# EAGLE board PoE_mag_main_alt3 (EAGLE 6.4)
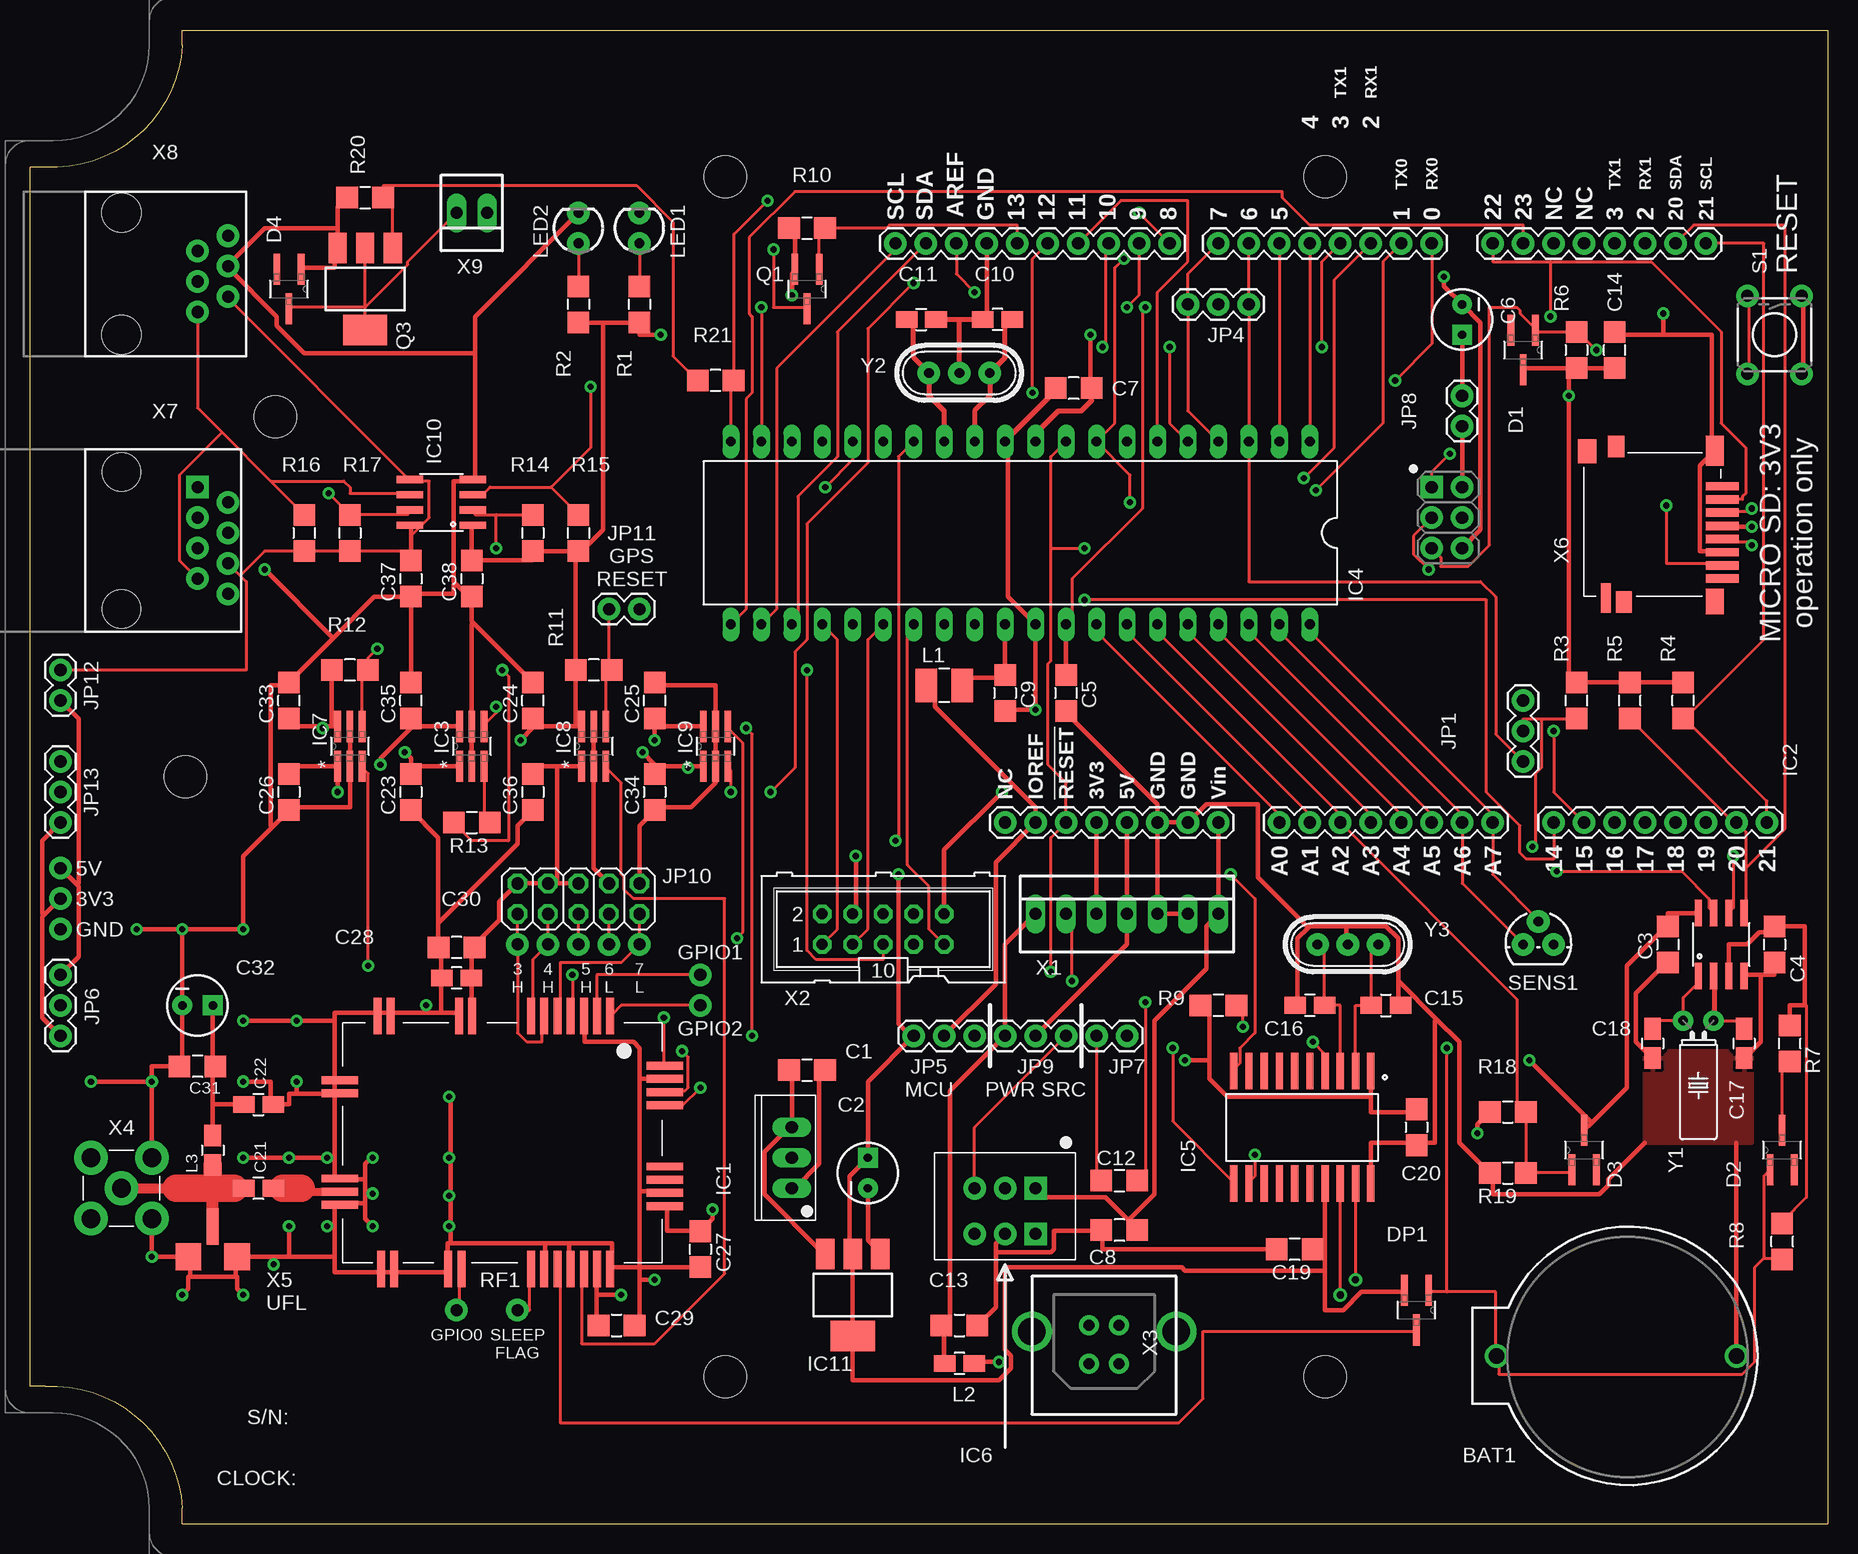
[diagram p4: board, top side]
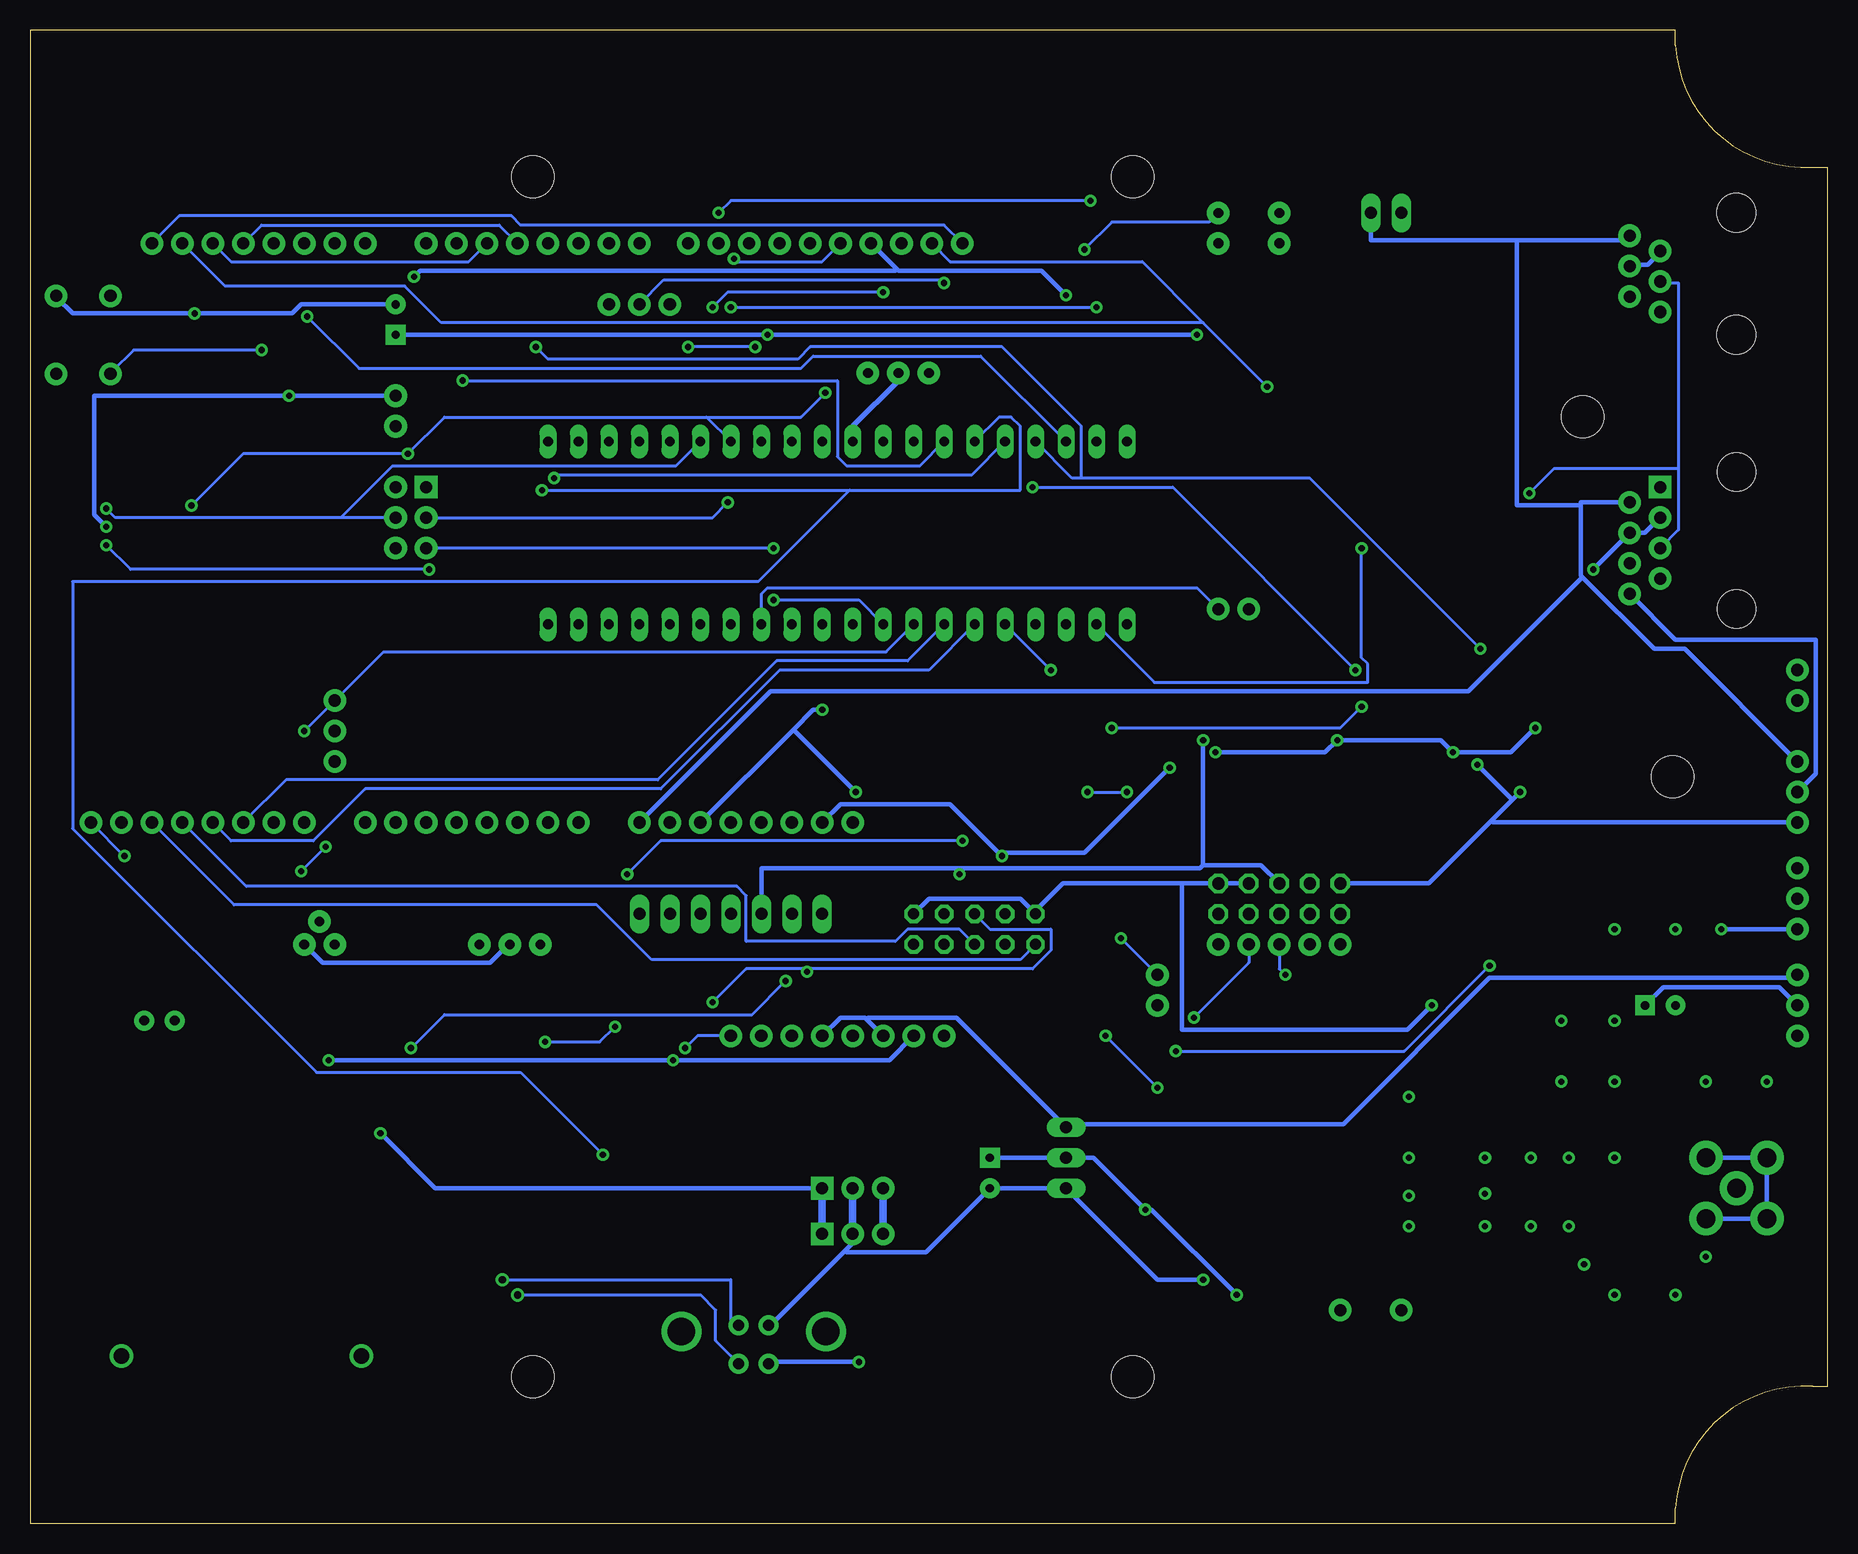
[diagram p5: board, bottom side, seen from below]

Size 149.86 x 124.46 mm. Coordinates in mm from the lower left corner, seen from the top.
Copper layers (1*16): Top 0.035mm / dielectric 1.5mm / Bottom 0.035mm
Design rules "SparkFun_Iteadstudio_10_12mil": minimum track width 10mil, minimum drill 20mil, track to track 12mil, track to pad 12mil, pad to pad 12mil, via to via 12mil, smd to smd 12mil, copper to edge 0.5mm, drill to drill 8mil, minimum pad ring 12mil, minimum via ring 10mil, stop-mask expansion 4mil, vias tented up to drill 25mil, thermal gap 10mil
Net classes: 1 power: width 0.381 mm; 2 antenna: width 0.66 mm

## Footprints (pad centres in the part's own frame; a part is rotated, then mirrored left to right if it is on the bottom)
BATTCOM_20MM_PTH = drill 1.3: 1 20,0; 2 0,0
FIBOX-PC-M-95-G-POE-MAG = hole 3.5: 0,50; 0,-50; -50,-50; -50,50; -95,0; -87.5,30
1206-HAND = smd 1.8 x 1.803: 1 -1.499,0; 2 1.499,0
CPOL-RADIAL-10UF-25V = drill 0.7 pad 1.651 square: 1 1.27,0 | drill 0.7 pad 1.651: 2 -1.27,0
0805-HAND = smd 1.8 x 1.4: 1 -1.225,0; 2 1.225,0
SOT23-3-HAND = smd 2.591 x 0.559: 1 -1.651,1.016; 2 -1.651,-1.016; 3 1.651,0
TO220 = drill 1.016 long: 1 -2.54,0; 2 0,0; 3 2.54,0
SO08 = smd 0.61 x 2.21: 1 -1.905,-2.616; 2 -0.635,-2.616; 3 0.635,-2.616; 4 1.905,-2.616; 5 1.905,2.616; 6 0.635,2.616; 7 -0.635,2.616; 8 -1.905,2.616
SOT23-6-HAND = smd 2.591 x 0.559: 1 -1.651,1.016; 2 -1.651,0; 3 -1.651,-1.016; 4 1.651,-1.016; 5 1.651,0; 6 1.651,1.016
DIL40 = drill 0.813 long: 1 -24.13,-7.62; 2 -21.59,-7.62; 3 -19.05,-7.62; 4 -16.51,-7.62; 5 -13.97,-7.62; 6 -11.43,-7.62; 7 -8.89,-7.62; 8 -6.35,-7.62; 9 -3.81,-7.62; 10 -1.27,-7.62; 11 1.27,-7.62; 12 3.81,-7.62; 13 6.35,-7.62; 14 8.89,-7.62; 15 11.43,-7.62; 16 13.97,-7.62; 17 16.51,-7.62; 18 19.05,-7.62; 19 21.59,-7.62; 20 24.13,-7.62; 21 24.13,7.62; 22 21.59,7.62; 23 19.05,7.62; 24 16.51,7.62; 25 13.97,7.62; 26 11.43,7.62; 27 8.89,7.62; 28 6.35,7.62; 29 3.81,7.62; 30 1.27,7.62; 31 -1.27,7.62; 32 -3.81,7.62; 33 -6.35,7.62; 34 -8.89,7.62; 35 -11.43,7.62; 36 -13.97,7.62; 37 -16.51,7.62; 38 -19.05,7.62; 39 -21.59,7.62; 40 -24.13,7.62
SO20 = smd 0.61 x 3.048: 1 -5.715,-4.699; 2 -4.445,-4.699; 3 -3.175,-4.699; 4 -1.905,-4.699; 5 -0.635,-4.699; 6 0.635,-4.699; 7 1.905,-4.699; 8 3.175,-4.699; 9 4.445,-4.699; 10 5.715,-4.699; 11 5.715,4.699; 12 4.445,4.699; 13 3.175,4.699; 14 1.905,4.699; 15 0.635,4.699; 16 -0.635,4.699; 17 -1.905,4.699; 18 -3.175,4.699; 19 -4.445,4.699; 20 -5.715,4.699
TSR-1-XXXX/POWERPAX-P78XX-10 = drill 1 pad 1.88 square: 1@A -2.54,0; 1@B -2.54,3.81 | drill 1 pad 1.88: 2@A 0,0; 2@B 0,3.81; 3@A 2.54,0; 3@B 2.54,3.81
SOT223-HAND = smd 1.524 x 2.54: 1 -2.3,-3.429; 2 0,-3.429; 3 2.3,-3.429 | smd 3.683 x 2.54: 4 0,3.429
1X03 = drill 1.016 pad 1.88: 1 0,0; 2 2.54,0; 3 5.08,0
1X02 = drill 1.016 pad 1.88: 1 0,0; 2 2.54,0
2X05 = drill 1.016 octagon: 1 -5.08,-1.27; 2 -5.08,1.27; 3 -2.54,-1.27; 4 -2.54,1.27; 5 0,-1.27; 6 0,1.27; 7 2.54,-1.27; 8 2.54,1.27; 9 5.08,-1.27; 10 5.08,1.27
1210-HAND = smd 1.8 x 2.794: 1 -1.499,0; 2 1.499,0
LED3MM = drill 0.813 pad 1.88: A -1.27,0; K 1.27,0
NVC08C-CSM-HAND = smd 0.66 x 3.048: P$1 -9,-10.535; P$2 -7.9,-10.535; P$3 -6.8,-10.535; P$4 -5.7,-10.535; P$5 -4.6,-10.535; P$6 -3.5,-10.535; P$7 -2.4,-10.535; P$8 2.5,-10.535; P$9 3.6,-10.535; P$10 9.3,-10.535; P$11 10.4,-10.535; P$17 10.1,10.535; P$18 9,10.535; P$19 4.5,10.535; P$20 3.4,10.535; P$21 -2.4,10.535; P$22 -3.5,10.535; P$23 -4.6,10.535; P$24 -5.7,10.535; P$25 -6.8,10.535; P$26 -7.9,10.535; P$27 -9,10.535 | smd 3.048 x 0.66: P$12 13.535,-5.2; P$13 13.535,-4.1; P$14 13.535,3; P$15 13.535,4.1; P$16 13.535,5.2; P$28 -13.535,5.3; P$29 -13.535,4.2; P$30 -13.535,3.1; P$31 -13.535,2; P$32 -13.535,-3.1; P$33 -13.535,-4.2; P$34 -13.535,-5.3; P$35 -13.535,-6.4
TACTILE-PTH = drill 1.016 pad 1.88: 1 -3.251,2.261; 2 3.251,2.261; 3 -3.251,-2.261; 4 3.251,-2.261
TO-92 = drill 0.813 pad 1.88: 1 -1.27,0; 2 0,1.905; 3 1.27,0
CALUNIUM-SHIELD-NO-OUTLINE-NO-HOLES-NO-TEXT-V3 = drill 1.016 pad 1.88: 0(RX0) 0,21.59; 1(TX0) -2.54,21.59; 2@0 -5.08,21.59; 2@1 17.78,21.59; 3.3V -27.94,-26.67; 3@0 -7.62,21.59; 3@1 15.24,21.59; 4 -10.16,21.59; 5 -12.7,21.59; 5V -25.4,-26.67; 6 -15.24,21.59; 7 -17.78,21.59; 8 -21.844,21.59; 9 -24.384,21.59; 10 -26.924,21.59; 11@0 -29.464,21.59; 12@0 -32.004,21.59; 13@0 -34.544,21.59; 14 10.16,-26.67; 15 12.7,-26.67; 16 15.24,-26.67; 17 17.78,-26.67; 18 20.32,-26.67; 19 22.86,-26.67; 20@0 25.4,-26.67; 20@1 20.32,21.59; 21@0 27.94,-26.67; 21@1 22.86,21.59; 22 5.08,21.59; 23 7.62,21.59; !ISP_RESET 0,-3.81; !RESET@0 -30.48,-26.67; A0 -12.7,-26.67; A1 -10.16,-26.67; A2 -7.62,-26.67; A3 -5.08,-26.67; A4/SDA -2.54,-26.67; A5/SCL 0,-26.67; A6 2.54,-26.67; A7 5.08,-26.67; AREF -39.624,21.59; GND@0 -22.86,-26.67; GND@1 -20.32,-26.67; GND@2 -37.084,21.59; GND@3 2.54,-3.81; IOREF -33.02,-26.67; ISP_MOSI 2.54,-1.27; ISP_SCK 0,-1.27; ISP_VCC 2.54,1.27; NC -35.56,-26.67; NC@0 12.7,21.59; NC@1 10.16,21.59; SCL -44.704,21.59; SDA -42.164,21.59; VIN -17.78,-26.67 | drill 1.016 pad 1.88 square: ISP_MISO 0,1.27
PAD = drill 1.016 pad 1.88: 1 0,0
22-23-2071 = drill 1 long: 1 -7.62,0; 2 -5.08,0; 3 -2.54,0; 4 0,0; 5 2.54,0; 6 5.08,0; 7 7.62,0
CON-HARTING-ML10 = drill 0.914 octagon: 1 -5.08,-1.27; 2 -5.08,1.27; 3 -2.54,-1.27; 4 -2.54,1.27; 5 0,-1.27; 6 0,1.27; 7 2.54,-1.27; 8 2.54,1.27; 9 5.08,-1.27; 10 5.08,1.27
USB-B-PTH-VERTICAL = drill 0.92 pad 1.676: D+ -1.25,0; D- -1.25,3.2; GND 1.25,0; VBUS 1.25,3.2 | drill 2.3: P$1 -6.02,0.5; P$2 6.02,0.5
SMA-THD = drill 1.549 pad 2.794: GND@0 -2.54,2.54; GND@1 2.54,2.54; GND@2 2.54,-2.54; GND@3 -2.54,-2.54; SIG 0,0
CONN-UFL-HAND-SOLDERING = smd 2.134 x 2.235: GND@0 -2.032,0; GND@1 2.032,0 | smd 1.016 x 3.048: SIGNAL 0,-2.54
MICRO-SD-SOCKET-HIROSE-DM3D = smd 0.7 x 2.75: CD/DAT3 6.6,-1.375; CLK 3.3,-1.375; CMD 5.5,-1.375; DAT0 1.1,-1.375; DAT1 0,-1.375; DAT2 7.7,-1.375; GND 2.2,-1.375; VDD 4.4,-1.375 | smd 1.8 x 1.3: P$11 -1.95,6.85 | smd 2.45 x 0.8: P$12 -1.625,8.35 | smd 1.8 x 1.4: P$13 11,7.5 | smd 2 x 1.55: P$14 10.6,9.925 | smd 2.5 x 1.5: SHIELD@0 10.65,-0.75 | smd 2.1 x 1.5: SHIELD@1 -1.9,-0.75
RJ45-8 = drill 1 pad 1.88 square: 1 -4.445,6.35 | drill 1 pad 1.88: 2 -3.175,8.89; 3 -1.905,6.35; 4 -0.635,8.89; 5 0.635,6.35; 6 1.905,8.89; 7 3.175,6.35; 8 4.445,8.89 | hole 3.2: -5.715,0; 5.715,0
RJ11-6 = drill 1.016 pad 1.88: 1 1.905,8.89; 2 3.175,6.35; 3 4.445,8.89; 4 5.715,6.35; 5 6.985,8.89; 6 8.255,6.35 | hole 3.251: 0,0; 10.16,0
22-23-2021 = drill 1 long: 1 -1.27,0; 2 1.27,0
TC38H = drill 0.813 pad 1.676: 1 -1.27,0; 2 1.27,0
HC49U-V-RESONATOR = drill 0.813 pad 1.88: 1 -2.54,0; 2 2.54,0; GND 0,0

## Placement (x,y rotation side)
BAT1  CR2032  [BATTCOM_20MM_PTH]  142.24,13.97 180 top
BOX1  BOXPOE-MAG-150-150  [FIBOX-PC-M-95-G-POE-MAG]  107.95,62.23 0 top
C1  1u  [1206-HAND]  64.77,37.78 0 top
C2  10u  [CPOL-RADIAL-10UF-25V]  69.85,29.21 90 top
C3  100n  [1206-HAND]  136.53,48.26 270 top
C4  100p  [1206-HAND]  145.41,48.26 270 top
C5  100n  [1206-HAND]  86.36,69.22 270 top
C6  4u7  [CPOL-RADIAL-10UF-25V]  119.38,100.33 270 top
C7  100n  [1206-HAND]  87,94.62 180 top
C8  1u  [1206-HAND]  90.81,24.45 180 top
C9  100n  [1206-HAND]  81.28,69.22 270 top
C10  22p  [0805-HAND]  80.64,100.33 180 top
C11  22p  [0805-HAND]  74.3,100.33 0 top
C12  100n  [1206-HAND]  90.81,28.57 0 top
C13  10n  [1206-HAND]  77.47,16.51 0 top
C14  100n  [1206-HAND]  132.08,97.79 90 top
C15  22p  [0805-HAND]  113.03,43.18 0 top
C16  22p  [0805-HAND]  106.68,43.18 180 top
C17  15p  [0805-HAND]  142.88,40 270 top
C18  15p  [0805-HAND]  135.25,40 270 top
C19  100n  [1206-HAND]  105.41,22.86 180 top
C20  100n  [1206-HAND]  115.57,33.02 270 top
C21  22p  [0805-HAND]  19.05,27.94 180 top
C22  22p  [0805-HAND]  19.05,34.92 0 top
C23  100n  [1206-HAND]  31.75,60.96 270 top
C24  100n  [1206-HAND]  41.91,68.58 90 top
C25  100n  [1206-HAND]  52.07,68.58 90 top
C26  100n  [1206-HAND]  21.59,60.96 270 top
C27  1u  [1206-HAND]  55.88,22.86 270 top
C28  22p  [0805-HAND]  35.56,45.47 180 top
C29  1u  [1206-HAND]  48.9,16.51 0 top
C30  1u  [1206-HAND]  35.56,48.01 180 top
C31  1u  [1206-HAND]  13.97,38.1 180 top
C32  4u7  [CPOL-RADIAL-10UF-25V]  13.97,43.18 0 top
C33  100n  [1206-HAND]  21.59,68.58 90 top
C34  100n  [1206-HAND]  52.07,60.96 270 top
C35  100n  [1206-HAND]  31.75,68.58 90 top
C36  100n  [1206-HAND]  41.91,60.96 270 top
C37  100n  [1206-HAND]  31.75,78.74 270 top
C38  100n  [1206-HAND]  36.83,78.74 270 top
D1  BAS40  [SOT23-3-HAND]  124.46,97.79 270 top
D2  BAS40  [SOT23-3-HAND]  146.05,31.11 90 top
D3  BAS40  [SOT23-3-HAND]  129.54,31.11 90 top
D4  BAS21  [SOT23-3-HAND]  21.59,102.87 270 top
DP1  BAS40-05  [SOT23-3-HAND]  115.57,17.78 270 top
IC1  LD1117V33  [TO220]  63.5,30.48 90 top
IC2  DS1338  [SO08]  140.97,48.26 0 top
IC3  74LVC1T45SOT23-HAND  [SOT23-6-HAND]  36.83,64.77 90 top
IC4  ATMEGA1284  [DIL40]  82.55,82.55 180 top
IC5  MCP2200  [SO20]  106.05,33.02 180 top
IC6  TSR 1-2450  [TSR-1-XXXX/POWERPAX-P78XX-10]  81.28,27.94 180 top
IC7  74LVC1T45SOT23-HAND  [SOT23-6-HAND]  26.67,64.77 90 top
IC8  74LVC1T45SOT23-HAND  [SOT23-6-HAND]  46.99,64.77 90 top
IC9  74LVC1T45SOT23-HAND  [SOT23-6-HAND]  57.15,64.77 90 top
IC10  PCA9517A  [SO08]  34.29,85.09 90 top
IC11  LD1117V33  [SOT223-HAND]  68.58,19.05 180 top
JP1  SQW  [1X03]  124.46,68.58 270 top
JP4  PPS  [1X03]  96.52,101.6 0 top
JP5  3V3/5V  [1X03]  73.66,40.64 0 top
JP6  V ANT  [1X03]  2.54,45.72 270 top
JP7  AUTO RST  [1X02]  91.44,40.64 180 top
JP8  ISP VCC  [1X02]  119.38,91.44 90 top
JP9  USB/VIN  [1X03]  86.36,40.64 180 top
JP10  CONFIG  [2X05]  45.72,52.07 0 top
JP11  GPS !RESET! (A0)  [1X02]  50.8,76.2 180 top
JP12  5V LINK  [1X02]  2.54,68.58 90 top
JP13  MAG VCC  [1X03]  2.54,63.5 270 top
L1  10uH  [1210-HAND]  76.2,69.85 180 top
L2  FERRITE  [0805-HAND]  77.47,13.33 180 top
L3  47n  [0805-HAND]  15.24,31.11 270 top
LED1  D13  [LED3MM]  50.8,107.95 90 top
LED2  PWR  [LED3MM]  45.72,107.95 90 top
Q1  BSS138  [SOT23-3-HAND]  64.77,102.87 270 top
Q3  BUK98150-55A  [SOT223-HAND]  27.94,102.87 180 top
R1  560R  [1206-HAND]  50.8,101.6 270 top
R2  560R  [1206-HAND]  45.72,101.6 270 top
R3  10k  [1206-HAND]  128.91,68.58 90 top
R4  4k7  [1206-HAND]  137.79,68.58 90 top
R5  4k7  [1206-HAND]  133.35,68.58 90 top
R6  10k  [1206-HAND]  128.91,97.79 270 top
R7  1k  [1206-HAND]  146.69,40 90 top
R8  0R  [1206-HAND]  146.05,23.49 90 top
R9  1k  [1206-HAND]  99.06,43.18 180 top
R10  1M  [1206-HAND]  64.77,107.95 0 top
R11  10k  [1206-HAND]  46.99,71.12 180 top
R12  100k  [1206-HAND]  26.67,71.12 180 top
R13  10k  [1206-HAND]  36.83,58.42 0 top
R14  10k  [1206-HAND]  41.91,82.55 270 top
R15  10k  [1206-HAND]  45.72,82.55 270 top
R16  10k  [1206-HAND]  22.86,82.55 270 top
R17  10k  [1206-HAND]  26.67,82.55 270 top
R18  3k 1%  [1206-HAND]  123.19,34.29 0 top
R19  1k 1%  [1206-HAND]  123.19,29.21 0 top
R20  1M  [1206-HAND]  27.94,110.49 0 top
R21  330R  [1206-HAND]  57.15,95.25 180 top
RF1  NV08C-CSM  [NVC08C-CSM-HAND]  39.37,31.75 180 top
S1  RESET  [TACTILE-PTH]  145.41,99.06 270 top
SENS1  LM61  [TO-92]  125.73,48.26 0 top
U$1  CALUNIUM-SHIELD-V3V3-NO-HOLES-NO-TEXT  [CALUNIUM-SHIELD-NO-OUTLINE-NO-HOLES-NO-TEXT-V3]  116.84,85.09 0 top
U$2  PAD  [PAD]  40.64,17.78 270 top
U$3  PAD  [PAD]  35.56,17.78 270 top
U$4  PAD  [PAD]  55.88,45.72 270 top
U$5  ?  [PAD]  55.88,43.18 270 top
U$6  PAD  [PAD]  40.64,48.26 270 top
U$7  PAD  [PAD]  43.18,48.26 270 top
U$8  PAD  [PAD]  45.72,48.26 270 top
U$9  PAD  [PAD]  48.26,48.26 270 top
U$10  PAD  [PAD]  50.8,48.26 270 top
U$11  PAD  [PAD]  2.54,52.07 0 top
U$12  PAD  [PAD]  2.54,54.61 0 top
U$13  PAD  [PAD]  2.54,49.53 0 top
X1  PWR  [22-23-2071]  91.44,50.8 0 top
X2  JTAG  [CON-HARTING-ML10]  71.12,49.53 0 top
X3  USB  [USB-B-PTH-VERTICAL]  89.53,16.51 180 top
X4  CONN-SMATHD  [SMA-THD]  7.62,27.94 270 top
X5  UFL  [CONN-UFL-HAND-SOLDERING]  15.24,22.22 180 top
X6  MICRO-SD-SOCKETHIROSE-DM3D  [MICRO-SD-SOCKET-HIROSE-DM3D]  139.7,78.74 90 top
X7  RJ45  [RJ45-8]  7.62,81.91 270 top
X8  RJ11  [RJ11-6]  7.62,109.22 270 top
X9  22-23-2021  [22-23-2021]  36.83,109.22 180 top
Y1  32k768  [TC38H]  139.06,41.91 180 top
Y2  16MHz  [HC49U-V-RESONATOR]  77.47,95.88 180 top
Y3  12MHz  [HC49U-V-RESONATOR]  109.86,48.26 180 top

## Tracks (layer width: path | path; a pad name or v marks a point on that pad's centre or on a via)
0(RX0)  (via drill 0.51)
  Top 0.254: v113.79,95.25 116.84,98.3 U$1.0(RX0) | v100.08,54.1 102.11,52.07 102.11,40.89 100.84,39.62 100.84,38.35 100.33,37.85 IC5.10 | v72.14,56.9 72.39,57.15 72.39,88.9 IC4.14
  Bottom 0.254: IC4.14 75.69,88.14 81.79,88.14 82.55,88.9 82.55,95.25 v113.79,95.25 | v100.08,54.1 97.28,56.9 v72.14,56.9
1(TX0)  (via drill 0.51)
  Top 0.254: v107.19,86.11 112.78,91.69 112.78,105.16 U$1.1(TX0) | v102.11,30.73 102.11,28.96 101.6,28.45 IC5.12
  Bottom 0.254: IC4.15 69.09,92.2 68.07,92.2 67.31,91.44 67.31,86.11 81.53,86.11 | v107.19,86.11 81.53,86.11 | v102.11,30.73 108.97,37.59 125.98,37.59 146.3,57.91 146.3,78.49 89.15,78.49 81.53,86.11
2(RX1)  (via drill 0.51)
  Top 0.254: v39.37,71.12 39.88,70.61 39.88,56.9 36.83,56.9 36.07,57.66 36.07,57.91 35.56,58.42 R13.1 | v66.29,86.36 68.58,88.65 IC4.16 | U$1.2@0 108.71,103.63 108.71,89.66 v106.17,87.12
  Bottom 0.254: U$1.2@0 113.28,105.16 133.1,105.16 U$1.2@1 | v39.37,71.12 54.61,86.36 v66.29,86.36 | v106.17,87.12 105.92,87.38 71.37,87.38 IC4.16
3(TX1)  (via drill 0.51)
  Top 0.254: IC7.4 27.69,70.87 27.94,71.12 R12.1 28.19,71.12 28.19,72.14 v28.96,72.9 | U$1.3@0 107.7,105.16 v107.7,98.04
  Bottom 0.254: U$1.3@0 110.74,108.2 130.56,108.2 U$1.3@1 | IC4.17 62.99,87.12 62.23,87.12 | 62.23,87.12 43.18,87.12 v28.96,72.9 | v107.7,98.04 106.68,97.03 85.85,97.03 84.84,98.04 68.83,98.04 62.23,91.44 62.23,87.12
4
  Top 0.254: U$1.4 IC4.1
5
  Top 0.254: U$1.5 IC4.2
6
  Top 0.254: U$1.6 JP4.3 IC4.3 101.6,78.49 120.9,78.49 122.17,77.22 122.17,65.79 JP1.3
7
  Top 0.254: IC4.4 96.52,92.71 JP4.1 96.52,104.14 U$1.7
8  (via drill 0.51)
  Top 0.254: IC4.20 58.42,95.25 R21.1 58.67,95.25 58.67,107.44 v61.47,110.24 | v92.46,109.22 U$1.8
  Bottom 0.254: v92.46,109.22 91.44,110.24 v61.47,110.24
9  (via drill 0.51)
  Top 0.254: v60.96,101.35 IC4.19 | v91.44,101.35 92.46,102.36 U$1.9
  Bottom 0.254: v91.44,101.35 v60.96,101.35
10  (via drill 0.51)
  Top 0.254: IC4.5 95,91.69 v95,98.04 | v89.41,98.04 89.66,98.3 89.66,106.43 U$1.10
  Bottom 0.254: v89.41,98.04 v95,98.04
11(MOSI)  (via drill 0.51)
  Top 0.254: v143.51,84.58 143.51,84.33 141.22,84.33 X6.CMD | U$1.11@0 90.93,110.24 96.52,110.24 96.52,105.16 93.98,102.62 IC4.6
  Bottom 0.254: v143.51,84.58 142.75,83.82 123.95,83.82 | U$1.ISP_MOSI 123.95,83.82 | IC4.6 96.01,88.14 119.63,88.14 123.95,83.82
12(MISO)  (via drill 0.51)
  Top 0.254: v136.4,84.84 136.4,80.01 140.97,80.01 X6.DAT0 | v118.36,89.15 116.84,87.63 U$1.ISP_MISO | U$1.12@0 83.57,105.41 v83.57,94.23
  Bottom 0.254: v136.4,84.84 132.08,89.15 v118.36,89.15 115.32,92.2 93.47,92.2 | 93.47,92.2 IC4.7 | v83.57,94.23 85.6,92.2 93.47,92.2
13(SCK)  (via drill 0.51)
  Top 0.254: Q1.1 65.79,107.7 66.04,107.95 R10.2 71.37,107.95 71.63,108.2 82.3,108.2 U$1.13@0 | v143.51,81.53 143.51,81.79 141.22,81.79 X6.CLK | v116.59,79.5 115.32,80.77 115.32,82.3 U$1.ISP_SCK | v91.69,85.09 91.69,87.38 IC4.8 90.42,91.69 90.42,104.65 v91.19,105.41
  Bottom 0.254: v143.51,81.53 141.48,79.5 v116.59,79.5 | v91.69,85.09 92.96,83.82 U$1.ISP_SCK | U$1.13@0 83.82,105.16 90.93,105.16 v91.19,105.41
14  (via drill 0.51)
  Top 0.254: v87.88,76.96 121.41,76.96 121.41,60.96 124.21,58.17 124.21,55.88 124.71,55.37 127,55.37 U$1.14
  Bottom 0.254: IC4.29 80.77,76.96 v87.88,76.96
15  (via drill 0.51)
  Top 0.254: U$1.15 127,60.96 v127,66.04
  Bottom 0.254: IC4.28 78.49,72.64 120.4,72.64 JP1.1 v127,66.04
16(TDI)
  Top 0.254: IC4.27 73.15,74.42 73.15,54.86 74.93,53.09 74.93,49.53 X2.9
  Bottom 0.254: U$1.16 128.52,61.98 97.54,61.98 87.63,71.88 76.71,71.88 IC4.27
17(TDO)
  Top 0.254: IC4.26 69.85,73.66 69.85,49.53 X2.3
  Bottom 0.254: U$1.17 133.1,56.9 126.24,56.9 121.92,61.21 97.28,61.21 87.38,71.12 74.93,71.12 IC4.26
18(TMS)  (via drill 0.51)
  Top 0.254: v64.77,71.12 64.77,47.75 65.53,46.99 71.12,46.99 X2.5
  Bottom 0.254: v64.77,71.12 IC4.25 | U$1.18 131.83,53.09 90.93,53.09 90.17,52.32 90.17,48.51 77.72,48.51 76.71,49.53 72.39,49.53 X2.5
19(TCK)
  Top 0.254: IC4.24 67.31,73.66 67.31,49.53 X2.1
  Bottom 0.254: U$1.19 132.84,51.56 102.62,51.56 98.04,46.99 67.31,46.99 X2.1
20(SDA)  (via drill 0.51)
  Top 0.254: R5.1 133.35,67.06 141.99,58.42 U$1.20@0 143,57.66 143,54.61 | 143,54.61 143,51.05 IC2.5 | U$1.20@1 138.68,108.2 146.3,108.2 146.3,57.91 143,54.61 | 43.43,86.36 45.72,84.07 R15.1 | 43.43,86.36 38.35,86.36 37.85,85.85 37.08,85.85 IC10.3 | IC4.23 64.01,75.44 64.01,85.6 67.31,88.9 67.31,99.31 U$1.SDA | 43.43,86.36 46.74,89.66 v46.74,94.74
  Bottom 0.254: 52.07,100.08 57.15,105.16 73.15,105.16 U$1.SDA | 52.07,100.08 v46.74,94.74 | U$1.20@1 133.6,103.12 118.62,103.12 115.57,100.08 52.07,100.08
21(SCL)  (via drill 0.51)
  Top 0.254: 137.92,67.06 144.78,60.2 U$1.21@0 | v141.99,55.63 141.99,51.31 141.73,51.05 IC2.6 | U$1.21@1 144.53,106.68 144.53,73.66 137.92,67.06 | 137.92,67.06 R4.1 | 38.86,84.07 37.08,84.07 37.08,84.33 IC10.2 | 38.86,84.07 41.91,84.07 R14.1 | IC4.22 62.23,76.2 62.23,96.27 72.14,106.17 U$1.SCL | v38.86,81.28 38.86,84.07
  Bottom 0.254: U$1.21@0 v141.99,55.63 | v38.86,81.28 38.86,72.14 38.35,71.63 38.35,70.1 56.13,70.1 IC4.22 | U$1.21@1 137.41,108.97 109.73,108.97 108.97,108.2 73.66,108.2 U$1.SCL
22  (via drill 0.51)
  Top 0.254: 126.75,105.16 121.92,105.16 U$1.22 | 126.75,105.16 135.13,105.16 140.97,99.31 140.97,91.69 143,89.66 143,85.85 142.75,85.6 142.75,85.34 141.22,85.34 X6.CD/DAT3 | 126.75,105.16 v126.75,100.58
  Bottom 0.254: IC4.18 70.61,97.28 84.58,97.28 85.6,96.27 122.43,96.27 v126.75,100.58
23
  Top 0.254: IC4.21 59.69,76.2 59.69,93.73 60.2,94.23 60.2,100.58 59.94,100.84 59.94,107.19 63.75,111 104.39,111 104.39,110.49 106.68,108.2 124.46,108.2 U$1.23
!GPS_RESET
  Top 0.254: IC8.3 48.01,62.99 49.28,61.72 49.28,54.1 49.53,53.85 49.53,52.83 50.29,52.07 57.91,52.07 57.91,20.83 52.07,14.99 45.97,14.99 45.97,21.08 RF1.P$25
!MCP2200_RESET  (via drill 0.51)
  Top 0.254: v101.09,41.4 101.09,42.67 100.58,43.18 R9.1 | v106.93,40.13 107.95,39.12 IC5.4
  Bottom 0.254: v101.09,41.4 102.36,40.13 v106.93,40.13
!RESET  (via drill 0.51)
  Top 0.254: S1.4 143.26,96.01 143.26,102.11 S1.3 | U$1.!ISP_RESET 117.6,80.52 117.6,79.76 119.89,79.76 121.67,81.53 121.67,101.35 123.95,101.35 124.21,101.09 124.21,100.84 125.48,99.57 D1.1 125.48,99.31 128.78,99.31 R6.1 129.03,99.31 v130.56,97.79 | IC4.9 85.09,88.9 85.09,81.28 | 85.09,81.28 85.09,71.88 84.84,71.63 84.84,63.25 86.36,61.72 U$1.!RESET@0 85.09,57.15 v85.09,45.97 | v92.96,43.43 92.96,29.21 92.46,28.7 C12.2 | 85.09,81.28 v87.88,81.28
  Bottom 0.254: v130.56,97.79 141.22,97.79 143,96.01 S1.4 | v92.96,43.43 90.17,46.23 85.09,46.23 | 85.09,46.23 66.29,46.23 64.77,47.75 64.77,49.53 69.85,49.53 X2.6 | 85.09,46.23 v85.09,45.97 | v87.88,81.28 U$1.!ISP_RESET
+3V3  (via drill 0.51)
  Top 0.381: 36.83,45.72 36.83,48.26 C30.1 | 37.34,48.51 37.08,48.26 C30.1 | 37.47,48.26 37.34,48.51 | 36.83,45.72 36.83,42.42 RF1.P$8 | 36.83,45.72 C28.1 | RF1.P$26 47.24,21.21 47.24,19.05 | 47.24,19.05 47.24,16.51 C29.1 | IC5.17 107.95,22.86 | 107.95,22.86 C19.1 | C26.1 21.59,63.12 IC7.1 v25.65,60.96 | IC3.6 31.75,66.42 C35.1 31.75,66.29 29.21,63.75 v29.21,63.25 | IC8.1 43.94,63.12 | 43.94,63.12 41.91,63.12 C36.1 | IC9.6 52.07,66.42 C25.1 v52.07,65.28 | 55.88,24.38 53.09,24.38 53.09,26.42 RF1.P$28 | 55.88,24.38 56.9,25.4 v56.9,26.16 | 55.88,24.38 C27.1 | v49.28,19.05 47.24,19.05 | 107.95,22.86 107.95,21.08 | 107.95,21.08 107.95,17.78 109.47,17.78 111,19.3 114.55,19.3 DP1.2 | 107.95,21.08 96.27,21.08 96.01,21.34 81.28,21.34 81.28,14.48 81.79,13.97 81.79,12.95 80.77,11.94 68.58,11.94 IC11.4 IC11.2 68.58,22.61 68.33,22.86 68.33,28.96 C2.1 69.85,36.83 JP5.1 73.41,40.64 72.39,41.66 v72.39,54.1 | JP6.3 1.02,42.16 1.02,50.55 1.14,50.67 | U$11.1 1.14,50.67 | JP13.3 1.02,56.9 1.02,50.8 1.14,50.67 | U$1.3.3V X1.3 | 43.94,53.34 JP10.6 | 43.94,53.34 43.94,63.12 | 43.94,53.34 JP10.4 JP10.2 39.12,51.82 39.12,50.29 37.34,48.51 | 37.34,48.51 C30.1
  Bottom 0.381: C2.1 IC1.2 61.21,30.48 v56.9,26.16 56.39,26.16 v49.28,19.05 | 28.07,58.55 33.27,53.34 JP10.2 | 28.07,58.55 26.29,60.32 | 26.29,60.32 v25.65,60.96 | 26.29,60.32 v29.21,63.25 | 52.07,54.86 v52.07,65.28 | 52.07,54.86 47.24,54.86 JP10.6 | X1.3 88.9,54.61 72.39,54.61 | 72.39,54.61 52.32,54.61 52.07,54.86 | JP13.3 27.94,58.42 28.07,58.55 | 72.39,54.61 v72.39,54.1
+5V
  Top 0.381: JP6.1 4.06,47.24 4.06,53.09 3.94,53.21 | U$12.1 3.94,53.21 | JP12.1 4.06,67.06 4.06,53.34 3.94,53.21 | 63.5,33.27 63.5,37.59 C1.1 | 63.5,33.27 61.21,30.99 61.21,27.43 66.04,22.61 IC11.3 | 63.5,33.27 IC1.3 | U$1.5V X1.4 91.44,48.26 JP9.2
  Bottom 0.381: 80.14,42.04 80.26,42.16 82.3,42.16 JP9.2 | 80.14,42.04 JP5.3 | 80.14,42.04 80.01,42.16 72.64,42.16 IC1.3 63.5,33.27 40.39,33.27 28.19,45.47 2.79,45.47 JP6.1
+5V_USB
  Top 0.381: 76.2,16.51 76.2,13.46 L2.2 | 76.2,16.51 76.71,17.02 76.71,36.07 JP9.3 81.28,48.26 X1.1 | 76.2,16.51 C13.1
A0
  Top 0.254: U$1.A0 104.14,59.05 88.9,74.29 IC4.33
  Bottom 0.254: JP11.1 52.58,77.98 88.39,77.98 88.9,77.47 IC4.33
A1
  Top 0.254: U$1.A1 106.68,59.05 91.44,74.29 IC4.34
A2
  Top 0.254: IC4.35 93.98,74.29 109.22,59.05 U$1.A2 123.95,43.69 123.95,34.8 124.46,34.29 R18.2 124.71,34.29 124.71,29.21 | 124.71,29.21 128.52,29.21 D3.1 | 124.71,29.21 R19.2
A3
  Top 0.254: U$1.A3 111.76,59.05 96.52,74.29 IC4.36
A4
  Top 0.254: U$1.A4/SDA 114.3,59.05 99.06,74.29 IC4.37
A5
  Top 0.254: U$1.A5/SCL 116.84,59.05 101.6,74.29 IC4.38
A6
  Top 0.254: IC4.39 104.14,74.29 119.38,59.05 U$1.A6 119.38,53.34 SENS1.1
A7
  Top 0.254: IC4.40 106.68,74.29 121.92,59.05 U$1.A7 121.92,54.1 125.73,50.29 SENS1.2
AREF  (via drill 0.51)
  Top 0.254: IC4.32 86.87,75.44 86.87,78.74 92.71,84.58 92.71,101.09 v92.96,101.35 | v78.74,102.62 77.22,104.14 U$1.AREF
  Top 0.381: IC4.32 86.36,70.87 C5.1 86.36,70.48
  Bottom 0.254: v92.96,101.35 91.69,102.62 v78.74,102.62
AUTO_RESET  (via drill 0.51)
  Top 0.254: v95.25,39.62 95.25,33.53 100.33,28.45 IC5.11
  Bottom 0.254: v95.25,39.62 94.23,40.64 JP7.1
AVCC
  Top 0.381: IC4.30 81.28,70.87 C9.1 81.28,70.48 77.47,70.48 77.47,69.85 L1.1 77.72,69.85 78.11,69.85
FAN_CTRL
  Top 0.254: Q3.4 27.94,101.35 | 27.94,101.35 Q3.2 | 27.94,101.35 21.59,101.35 D4.3 | X9.2 31.5,105.16 31.5,104.9 27.94,101.35
GND  (via drill 0.51)
  Top 0.381: X4.GND@1 v10.16,22.22 X5.GND@1 13.34,22.22 13.34,20.57 | 30.48,20.95 29.21,20.95 | 29.21,20.95 25.4,20.95 25.4,22.22 | 29.21,20.95 RF1.P$17 | 30.48,20.95 34.92,20.95 RF1.P$19 34.8,21.34 34.8,23.37 35.05,23.37 | 30.48,20.95 RF1.P$18 | 25.4,26.67 25.91,26.42 RF1.P$16 25.4,26.67 | 22.23,35.81 25.65,35.81 RF1.P$13 | 25.4,30.48 25.4,35.85 RF1.P$13 | 25.4,30.48 25.4,28.75 RF1.P$14 25.91,28.7 27.94,28.7 | 25.4,36.83 25.4,36.07 RF1.P$13 | 30.1,42.54 29.21,42.54 | 29.21,42.54 RF1.P$11 28.96,42.54 | RF1.P$9 35.56,42.54 34.29,42.54 | 34.29,42.54 33.02,42.54 | 33.02,42.54 30.1,42.54 | 30.1,42.54 RF1.P$10 | 28.96,42.54 29.21,42.54 | 25.4,41.91 25.4,42.54 28.96,42.54 | 25.4,41.91 25.4,36.83 | 25.4,36.83 RF1.P$12 | 27.94,26.67 25.4,26.67 | 27.94,28.7 27.94,27.69 | 27.94,27.69 27.94,26.67 | 25.4,22.22 21.59,22.22 | 21.59,22.22 20.32,22.22 | 20.32,22.22 X5.GND@0 17.14,22.22 17.14,20.57 | 25.4,26.67 25.4,24.89 | 25.4,24.89 25.4,22.22 | 50.8,37.08 52.83,37.08 RF1.P$34 | 50.8,27.69 50.8,37.08 | 50.8,27.69 52.83,27.69 RF1.P$29 | 50.8,37.08 50.8,39.62 50.29,40.13 46.23,40.13 46.23,42.16 RF1.P$3 | 51.05,16.51 50.8,16.51 | 50.8,16.51 C29.2 | IC8.5 IC8.2 46.99,54.61 JP10.8 | 42.93,23.37 42.93,21.34 RF1.P$22 | 44.96,23.37 42.93,23.37 | 44.96,23.37 44.96,21.34 RF1.P$24 | 48.51,21.34 50.8,21.34 | 50.8,21.34 55.88,21.34 C27.2 | 48.51,21.34 RF1.P$27 | 44.96,23.37 48.51,23.37 48.51,21.34 | 50.8,21.34 50.8,27.69 | 42.93,23.37 35.05,23.37 | 34.29,45.72 34.29,48.26 C30.2 34.04,48.26 34.04,50.04 | 34.29,42.54 34.29,45.72 | 34.29,45.72 C28.2 | 17.14,20.57 13.34,20.57 | IC5.20 111.76,31.75 115.57,31.75 | 50.8,21.34 50.8,20.32 | 50.8,20.32 50.8,16.51 | v52.07,20.32 50.8,20.32
  Top 0.381: 142.88,45.49 IC2.4 142.88,45.72 144.27,45.72 | 144.27,45.72 145.41,45.72 C4.2 | 22.23,35.81 21.59,35.81 21.59,34.92 C22.2 20.07,35.05 20.07,36.83 v17.78,36.83 | 22.23,35.81 v22.23,36.83 | C3.2 136.4,46.74 133.86,44.2 133.86,40.13 135.13,38.86 C18.2 | 144.27,45.72 144.27,40.13 143,38.86 C17.2 | 142.24,31.75 BAT1.2 | X1.6 X1.5 U$1.GND@0 | U$1.GND@0 93.98,59.94 86.36,67.56 C5.2 | U$1.GND@0 U$1.GND@1 98.04,59.94 102.36,59.94 102.36,53.85 106.55,49.66 | 106.55,49.66 106.68,49.78 109.73,49.78 | 106.55,49.66 105.66,48.77 105.66,43.18 C16.2 | 109.73,49.78 109.73,48.26 Y3.GND | 114.05,45.21 114.05,48.77 113.03,49.78 109.73,49.78 | 114.05,45.21 114.05,43.18 C15.2 | 114.05,45.21 117.22,42.04 | 117.22,42.04 119.13,40.13 119.13,31.75 121.67,29.21 R19.1 121.92,29.21 121.92,27.43 130.81,27.43 131.57,28.19 131.57,28.7 134.62,31.75 | 115.57,31.75 117.09,31.75 117.09,41.91 117.22,42.04 | 115.57,31.75 C20.2 | 136.14,99.06 140.21,99.06 140.21,89.41 X6.SHIELD@0 140.21,89.15 139.19,88.14 139.19,81.03 140.97,81.03 X6.GND | 136.14,99.06 132.08,99.06 C14.2 | S1.2 147.83,96.01 147.83,102.11 S1.1 | U$1.GND@3 120.9,82.8 120.9,100.08 C6.2 117.86,103.12 v117.86,103.89 | v136.14,100.84 136.14,99.06 | R10.1 63.5,107.95 63.75,107.7 Q1.2 63.75,104.39 63.5,104.14 v63.5,102.36 | C9.2 81.28,67.82 v83.82,67.82 IC4.31 81.53,77.22 81.53,90.17 IC4.11 | U$1.GND@2 79.76,100.58 79.5,100.33 C10.2 | 25.27,73.79 28.7,77.22 31.75,77.22 | 25.27,73.79 21.59,70.1 C33.2 21.59,69.85 20.07,69.85 20.07,58.17 20.19,58.04 | 31.75,77.22 C35.2 | 31.75,77.22 C37.2 31.75,77.47 35.31,77.47 35.31,78.23 35.43,78.36 | 25.27,73.79 v19.56,79.5
  Top 0.381: 25.65,107.95 25.65,106.43 Q3.3 25.4,106.17 25.4,104.65 22.61,104.65 D4.1 | 25.65,107.95 25.65,109.73 26.42,110.49 R20.1 | 25.65,107.95 19.56,107.95 16.51,104.9 X8.3 16.51,104.65 20.57,100.58 20.57,99.82 22.86,97.54 37.08,97.54 | IC3.2 IC3.5 36.83,74.93 36.96,75.06 | 36.83,87.12 IC10.4 | 36.96,75.06 36.83,75.18 36.83,76.96 | 36.96,75.06 41.91,70.1 C24.2 | 36.83,76.96 C38.2 36.83,77.22 | 36.83,76.96 35.43,78.36 | 35.43,78.36 35.31,78.49 35.31,86.87 36.83,86.87 IC10.4 | LED2.K 37.08,100.58 37.08,97.54 | 37.08,97.54 37.08,87.12 IC10.4 | 71.12,22.61 IC11.1 70.87,22.61 69.85,23.62 C2.2 | IC1.1 63.75,27.94 65.79,29.97 65.79,37.34 66.04,37.59 C1.2 | 80.52,22.61 80.52,23.37 IC6.2@B | 80.52,22.61 80.52,18.03 78.99,16.51 C13.2 | 80.52,22.61 85.09,22.61 85.34,22.86 85.34,24.38 89.15,24.38 C8.2 89.41,24.38 89.41,22.86 C19.2 | IC7.5 IC7.2 26.67,59.69 21.59,59.69 C26.2 21.59,59.44 20.19,58.04 | v12.7,49.53 v8.89,49.53 | v12.7,49.53 v17.78,49.53 17.78,55.63 20.19,58.04 | v10.16,36.83 v5.08,36.83 | v10.16,36.83 10.16,38.1 C31.2 12.7,38.1 C32.2 v12.7,49.53 | C25.2 52.07,69.85 57.15,69.85 IC9.5 57.15,63.25 IC9.2 57.15,61.72 55.12,59.69 52.07,59.69 C34.2 52.07,59.44 50.8,58.17 JP10.10 | v17.78,41.91 v22.23,41.91 25.4,41.91 | v17.78,30.48 v21.59,30.48 v24.77,30.48 25.4,30.48 | v12.7,19.05 13.21,19.56 13.21,20.57 13.34,20.57 | v17.78,19.05 17.27,19.56 17.27,20.57 17.14,20.57 | 20.32,22.22 v20.32,21.59 | 21.59,22.22 v21.59,24.76 | 25.4,24.89 24.89,24.89 v24.77,24.76 | v28.57,24.76 27.94,25.4 27.94,26.67 | 35.05,23.37 35.05,24.64 v34.92,24.76 35.05,24.89 35.05,27.18 v34.92,27.3 35.05,27.43 35.05,30.48
  Top 0.381: 27.94,27.69 28.45,27.69 v28.57,27.5 | 27.94,28.7 27.94,29.97 28.45,30.48 v28.57,30.48 | 35.05,30.48 35.05,35.56 v34.92,35.56 | 35.05,30.48 v34.92,30.48 | 33.02,42.54 v33.02,43.18 | 34.04,50.04 34.04,57.15 31.75,59.44 C23.2 | 34.04,50.04 40.64,56.64 40.64,58.17 41.91,59.44 C36.2 | X4.GND@0 v10.16,36.83 | v81.03,60.96 76.2,56.13 X2.10
  Top 0.406: IC4.11 85.5,94.39 C7.2 | Y2.GND 77.47,100.33 | 77.47,100.33 C11.2 | C10.2 77.47,100.33
  Bottom 0.381: X4.GND@0 X4.GND@3 X4.GND@2 X4.GND@1 | SENS1.3 125.48,46.74 111.51,46.74 109.98,48.26 Y3.GND | C6.2 127.25,101.6 128.02,100.84 v136.14,100.84 146.3,100.84 147.57,102.11 S1.1 | v63.5,102.36 65.53,104.39 77.47,104.39 77.6,104.52 | U$1.GND@2 77.6,104.52 | v117.86,103.89 117.35,104.39 77.72,104.39 77.6,104.52 | 86.23,66.17 84.58,67.82 v83.82,67.82 | 86.23,66.17 U$1.GND@0 | X7.3 15.24,82.55 X7.4 v19.56,79.5 | X8.2 13.97,105.92 14.99,104.9 16.51,104.9 X8.3 | 81.92,22.73 81.28,23.37 IC6.2@B | 81.92,22.73 88.14,16.51 X3.GND | 81.92,22.73 81.79,22.61 75.18,22.61 C2.2 IC1.1 55.88,20.32 v52.07,20.32 | v8.89,49.53 U$13.1 | X2.10 74.93,52.07 67.31,52.07 X2.2 66.04,51.05 63.75,53.34 53.85,53.34 | JP10.8 JP10.10 53.85,53.34 | 53.85,53.34 53.85,41.15 35.05,41.15 v33.02,43.18 | v81.03,60.96 86.23,66.17
  Bottom 0.406: Y2.GND 77.47,95.25 81.28,91.44 IC4.11
  pour Top (isolate 0.61): 134.62,39.37 143.51,39.37 143.51,31.75 134.62,31.75
GPIO0
  Top 0.254: U$3.1 35.81,17.78 35.81,21.08 RF1.P$20
GPIO1  (via drill 0.51)
  Top 0.254: U$4.1 47.24,45.72 47.24,42.42 RF1.P$2 | v58.93,48.77 59.44,49.28 59.44,65.02 58.17,66.29 IC9.4
  Bottom 0.254: U$4.1 v58.93,48.77
GPIO2
  Top 0.254: U$5.1 49.28,43.18 48.51,42.42 RF1.P$1
GPIO3
  Top 0.254: RF1.P$6 42.67,42.16 42.67,40.13 41.4,40.13 40.64,40.89 U$6.1 JP10.1
GPIO4
  Top 0.254: RF1.P$7 41.91,42.42 41.91,46.99 U$7.1 JP10.3
GPIO5  (via drill 0.51)
  Top 0.254: v45.21,45.72 45.21,42.42 RF1.P$4 | U$8.1 JP10.5
  Bottom 0.254: v45.21,45.72 45.72,46.23 U$8.1
GPIO6  (via drill 0.51)
  Top 0.254: U$9.1 JP10.7 | v52.83,42.16 52.83,38.35 RF1.P$35
  Bottom 0.254: v52.83,42.16 48.26,46.74 U$9.1
GPIO7
  Top 0.254: RF1.P$5 44.2,42.42 44.2,46.74 49.28,46.74 U$10.1 JP10.9
GPS_RX1  (via drill 0.51)
  Top 0.254: RF1.P$33 53.09,36.07 54.61,36.07 54.86,36.32 54.86,38.86 v54.36,39.37 | v28.19,46.48 28.19,62.48 27.69,62.99 IC7.3
  Bottom 0.254: v28.19,46.48 35.31,39.37 v54.36,39.37
GPS_TX1  (via drill 0.51)
  Top 0.254: 54.36,34.8 53.09,34.8 RF1.P$32 54.36,34.8 | v38.86,68.07 38.86,67.56 37.85,66.55 IC3.4 | v59.69,66.29 60.2,65.79 v60.2,40.64 | 54.36,34.8 v55.88,36.32
  Bottom 0.254: v38.86,68.07 40.64,66.29 v59.69,66.29 | v55.88,36.32 v60.2,40.64
MAG_SCL  (via drill 0.51)
  Top 0.254: 26.67,84.07 31.5,84.07 31.5,84.33 IC10.7 | v24.89,85.85 26.67,84.07 | 26.67,84.07 R17.1
  Bottom 0.254: X7.5 12.45,82.8 12.45,87.88 | 12.45,87.88 12.45,103.38 13.97,103.38 X8.4 | v24.89,85.85 22.86,87.88 12.45,87.88
MAG_SDA
  Top 0.254: 16,90.93 13.97,92.96 X8.6 | 16,90.93 20.07,86.87 | 20.07,86.87 22.86,84.07 R16.1 | 20.07,86.87 26.16,86.87 26.67,86.36 26.67,85.85 31.5,85.85 IC10.6 | X7.7 12.45,80.26 12.45,87.38 16,90.93
MAG_VCC
  Top 0.254: JP12.2 18.03,71.12 18.03,78.49 17.53,78.99 | X7.6 17.53,78.99 | 26.67,81.03 22.86,81.03 | 31.75,82.3 33.27,83.82 33.27,86.87 31.75,86.87 IC10.5 31.5,87.12 16.51,102.11 X8.5 | 31.75,81.03 26.67,81.03 | 26.67,81.03 R17.2 | 17.53,78.99 19.56,81.03 22.86,81.03 | 22.86,81.03 R16.2
  Top 0.381: IC10.8 31.75,83.19 31.75,82.3 31.75,81.03 C37.1
N$1
  Top 0.254: 73.66,100.33 C11.1
  Top 0.406: IC4.13 76.2,92.71 74.93,93.98 Y2.2 73.66,97.16 73.66,100.33
N$2
  Top 0.254: 81.28,100.33 C10.1
  Top 0.406: IC4.12 78.74,92.71 80.01,93.98 Y2.1 81.28,97.16 81.28,100.33
N$3
  Top 0.254: LED1.A R1.1
N$4  (via drill 0.51)
  Top 0.254: v61.98,106.17 61.98,101.35 64.77,101.35 Q1.3
  Bottom 0.254: v61.98,106.17 59.69,108.46 51.56,108.46 LED1.K
N$5
  Top 0.254: 138.94,44.96 137.79,43.81 Y1.2 135.38,41.91 | 138.94,44.96 139.06,45.08 IC2.1 | IC2.1 139.06,45.72 | 135.38,41.91 135.25,41.91 135.25,41.27 | 135.38,41.91 135.38,41.4 C18.1 | 138.94,44.96 138.94,45.47 IC2.1
N$6
  Top 0.381: JP8.1 U$1.ISP_VCC
N$7
  Top 0.254: IC5.3 109.22,43.18 C16.1 107.91,47.67 Y3.2
N$8
  Top 0.254: LED2.A R2.1
N$9
  Top 0.254: D2.3 146.05,37.85 146.56,38.35 R7.1
N$11
  Top 0.254: R8.2 146.05,25.15 148.08,27.18 148.08,43.18 147.96,43.18
  Top 0.381: IC2.3 141.6,48.26 143.13,48.26 144.15,49.28 145.41,49.28 145.41,49.53 144.78,49.53 C4.1 147.96,49.76 147.96,43.18 146.69,43.18 R7.2
N$12
  Top 0.254: IC2.2 Y1.1 140.46,41.91 | IC2.2 140.34,45.72 | 140.46,41.91 142.75,41.91 | 142.75,41.91 142.88,41.91 142.88,41.27 | 142.75,41.91 142.75,41.4 C17.1 | 140.46,41.91 140.46,45.47 IC2.2
N$14
  Top 0.254: JP9.1 78.74,33.02 IC6.3@A
N$15
  Top 0.254: JP7.2 88.9,28.96 89.15,28.7 C12.1
N$18
  Top 0.254: IC5.2 110.49,43.18 C15.1 111.81,47.67 Y3.1
N$22
  Top 0.254: 48.26,71.12 48.01,70.87 IC8.4 | 48.26,71.12 JP11.2 | 48.26,71.12 R11.1
N$23
  Top 0.762: 17.02,27.94 C21.2
  Top 0.813: X4.SIG 12.19,27.94
  Top 1.016: X5.SIGNAL 15.24,27.94
  Top 1.524: 15.24,27.94 L3.2
  Top 2.311: 12.19,27.94 15.24,27.94 17.02,27.94
N$24
  Top 0.66: 22.61,27.94 22.86,27.65 RF1.P$15
  Top 0.762: 21.08,27.94 C21.1
  Top 2.311: 22.61,27.94 21.08,27.94
N$25
  Top 0.254: IC3.3 37.85,58.67 38.1,58.42 R13.2
N$26
  Bottom 0.381: JP13.2 1.02,62.48 1.02,73.66 12.7,73.66 X7.8
N$29
  Top 0.254: 29.46,110.49 30.23,109.73 30.23,106.43 Q3.1 | 29.46,110.49 29.46,111.51 50.55,111.51 53.59,108.46 53.59,97.28 55.63,95.25 R21.2 | 29.46,110.49 R20.2
PPS  (via drill 0.51)
  Top 0.254: v58.42,60.96 58.42,62.74 58.17,62.99 IC9.3 | v61.72,60.96 63.75,62.99 63.75,72.64 64.77,73.66 64.77,83.31 69.85,88.39 69.85,99.57 v73.66,103.38
  Bottom 0.254: v61.72,60.96 v58.42,60.96 | v73.66,103.38 73.91,103.63 97.03,103.63 JP4.2
SLEEP_FLAG
  Top 0.254: U$2.1 41.66,17.78 41.66,21.08 RF1.P$21
SQW  (via drill 0.51)
  Top 0.254: 125.98,67.06 124.46,67.06 JP1.2 | 125.98,67.06 128.78,67.06 R3.1 | v127.25,54.36 137.67,54.36 139.95,52.07 139.95,51.31 140.21,51.05 IC2.7 | v125.22,56.39 125.48,56.64 125.48,62.48 125.98,62.99 125.98,67.06
  Bottom 0.254: v125.22,56.39 v127.25,54.36
USB_D+  (via drill 0.6)
  Top 0.254: IC5.19 v110.49,20.32
  Bottom 0.254: X3.D+ 91.44,16.51 91.44,20.32 v110.49,20.32
USB_D-  (via drill 0.6)
  Top 0.254: v109.22,19.05 IC5.18
  Bottom 0.254: X3.D- 91.42,13.94 92.71,15.24 92.71,17.78 93.98,19.05 v109.22,19.05
V_ANT
  Top 0.381: L3.1 15.24,34.92 | 15.24,34.92 15.24,37.87 C31.1 15.24,38.1 C32.1 | C22.1 15.24,34.92
  Bottom 0.381: JP6.2 4.06,44.7 13.72,44.7 C32.1
V_BACKUP
  Top 0.254: DP1.3 115.57,16 97.79,16 97.79,10.41 95.76,8.38 44.2,8.38 44.2,21.08 RF1.P$23
VBATT  (via drill 0.51)
  Top 0.254: 144.53,22.1 146.05,22.1 R8.1 | 144.53,22.1 144.53,28.96 D2.1 | 118.11,19.3 122.17,19.3 122.17,13.97 BAT1.1 122.43,13.97 122.43,12.45 142.75,12.45 143.76,13.46 143.76,21.34 144.53,22.1 | 118.11,19.3 116.59,19.3 DP1.1 | X1.2 86.87,50.29 v86.87,45.21 | 118.11,19.3 v118.11,39.62
  Bottom 0.254: v86.87,45.21 89.66,42.42 115.32,42.42 v118.11,39.62
VBUS  (via drill 0.51)
  Top 0.381: v80.77,13.46 78.74,13.46 L2.1
  Bottom 0.381: v80.77,13.46 88.14,13.46 X3.VBUS
VCC  (via drill 0.51)
  Top 0.381: IC5.1 111.76,35.56 | 111.76,35.56 111.76,34.29 115.57,34.29 C20.1 | IC7.6 25.15,66.42 | 25.15,66.42 24.38,66.42 | 24.38,66.42 21.59,66.42 C33.1 | IC3.1 31.75,63.12 C23.1 31.75,63.75 v31.24,64.26 | IC8.6 45.47,66.42 | 45.47,66.42 41.91,66.42 C24.1 41.91,66.29 v40.89,65.28 | IC9.1 54.86,63.12 | 54.86,63.12 52.07,63.12 C34.1 52.07,63.25 v51.05,64.26 | IC10.1 36.83,83.19 36.83,80.26 | IC2.8 136.53,50.88 C3.1 136.4,49.78 133.1,46.48 133.1,36.32 130.18,33.4 | 133.35,70.1 129.03,70.1 R3.2 128.78,70.1 128.27,70.61 v128.27,93.98 128.27,96.27 | 133.35,70.1 137.67,70.1 R4.2 | 133.35,70.1 R5.2 | R6.2 129.03,96.27 132.08,96.27 C14.1 | 128.27,96.27 128.78,96.27 R6.2 | 128.27,96.27 124.46,96.27 D1.3 | 128.27,96.27 R6.2 | v143.51,83.06 141.22,83.06 X6.VDD | JP8.2 C6.1 | v88.39,99.06 88.39,94.74 C7.1 | 25.15,66.42 25.15,71.12 R12.2 | v24.38,66.29 24.38,66.42 | 50.8,100.08 47.75,100.08 | 47.75,100.08 45.72,100.08 R2.2 | 45.47,66.42 45.47,71.12 | 45.47,81.03 45.72,81.03 R15.2 | 45.47,81.03 41.91,81.03 | 45.47,81.03 45.47,80.52 | 45.47,80.52 45.47,71.12 | 45.47,71.12 R11.2 | 45.47,81.03 R15.2 | 36.83,80.26 41.91,80.26 41.91,81.03 | 36.83,80.26 C38.1 | 41.91,81.03 R14.2 | 47.75,100.08 47.75,82.8 45.47,80.52 | 45.47,80.52 R15.2 | 130.18,33.4 D3.3 | 98.3,38.61 98.3,37.08 99.82,35.56 111.76,35.56 | 98.3,38.61 98.3,42.67 97.79,43.18 R9.2 | L1.2 74.93,69.85 75.44,69.34 75.44,68.07 83.82,59.69 U$1.IOREF 80.52,55.12 80.52,44.96 JP5.2 | X2.4 68.83,51.05 v68.83,55.63 | v54.86,62.99 54.86,63.12 | v96.27,38.61 98.3,38.61 | v124.97,38.61 130.18,33.4 | v52.58,99.06 50.8,99.06 50.8,100.08 | 50.8,100.08 R1.2
  Top 0.406: IC4.10 83.82,90.81 85.72,92.71 87.63,92.71 88.49,93.57 C7.1
  Bottom 0.381: v143.51,83.06 144.53,84.07 144.53,93.98 v128.27,93.98 JP8.2 | C6.1 v88.39,99.06 v52.58,99.06 | v24.38,66.29 26.42,64.26 v31.24,64.26 32.26,65.28 v40.89,65.28 41.91,64.26 v51.05,64.26 | U$1.IOREF 82.3,59.94 73.15,59.94 v68.83,55.63 68.83,55.88 61.98,55.88 v54.86,62.99 | JP5.2 78.23,38.61 v96.27,38.61 v124.97,38.61
VIN  (via drill 0.51)
  Top 0.381: U$1.VIN X1.7 98.04,49.78 98.04,46.23 93.73,41.91 93.73,27.43 91.57,25.27 | 91.57,25.27 89.66,27.18 83.82,27.18 IC6.1@A | 91.57,25.27 92.2,24.64 C8.1 | v120.65,32.51 120.65,33.27 121.67,34.29 R18.1
  Bottom 0.381: v120.65,32.51 116.08,27.94 IC6.1@A | X9.1 38.1,106.93 25.91,106.93 | 25.91,106.93 16.76,106.93 16.51,107.19 X8.1 | JP13.1 11.94,72.9 14.48,72.9 20.45,78.87 | 20.45,78.87 20.57,78.99 20.57,84.84 | 20.57,84.84 20.57,85.09 X7.2 | 25.91,106.93 25.91,84.84 20.57,84.84 | U$1.VIN 88.14,69.34 29.97,69.34 20.45,78.87

## Text on the board
tPlace: TX1 | RX1 | TX0 | RX0 | TX1 | RX1 | SDA | SCL
tNames: Check footprint of RJ45/RJ11 | Use TO-220 for LD117 / Move decoupling caps for it | RESET | S/N: | CLOCK:
tValues: 3V3 | VIN | PPS 7 | JP4: / PPS / PIN | PPS 6 | FAN | POWER | STATUS | FAN | D7/D6 | D6/D15 | 3V3/VIN | 3V3 | 5V | 3V3/5V | AUTO / RESET | GPS / ANTENNA | USB | 3V3 | 3V3 | JP5: MCU / OPERATION | MHz | JP9: POWER / SOURCE | 5V | 5V
tSilk: 3 / H | 4 / H | 5 / H | 6 / L | 7 / L | GPIO1 | GPIO2 | GPIO0 | SLEEP / FLAG
_tsilk: 4 | 3 | 2 | SCL | SDA | AREF | GND | 13 | 12 | 11 | 10 | 9 | 8 | 7 | 6 | 5 | 1 | 0 | 22 | 23 | NC | NC | 3 | 2 | 20 | 21 | MICRO SD: 3V3 / operation only | GPS / RESET | NC | IOREF | !RESET | 3V3 | 5V | GND | GND | Vin | A0 | A1 | A2 | A3 | A4 | A5 | A6 | A7 | 14 | 15 | 16 | 17 | 18 | 19 | 20 | 21 | 5V | 3V3 | GND | MCU | PWR SRC